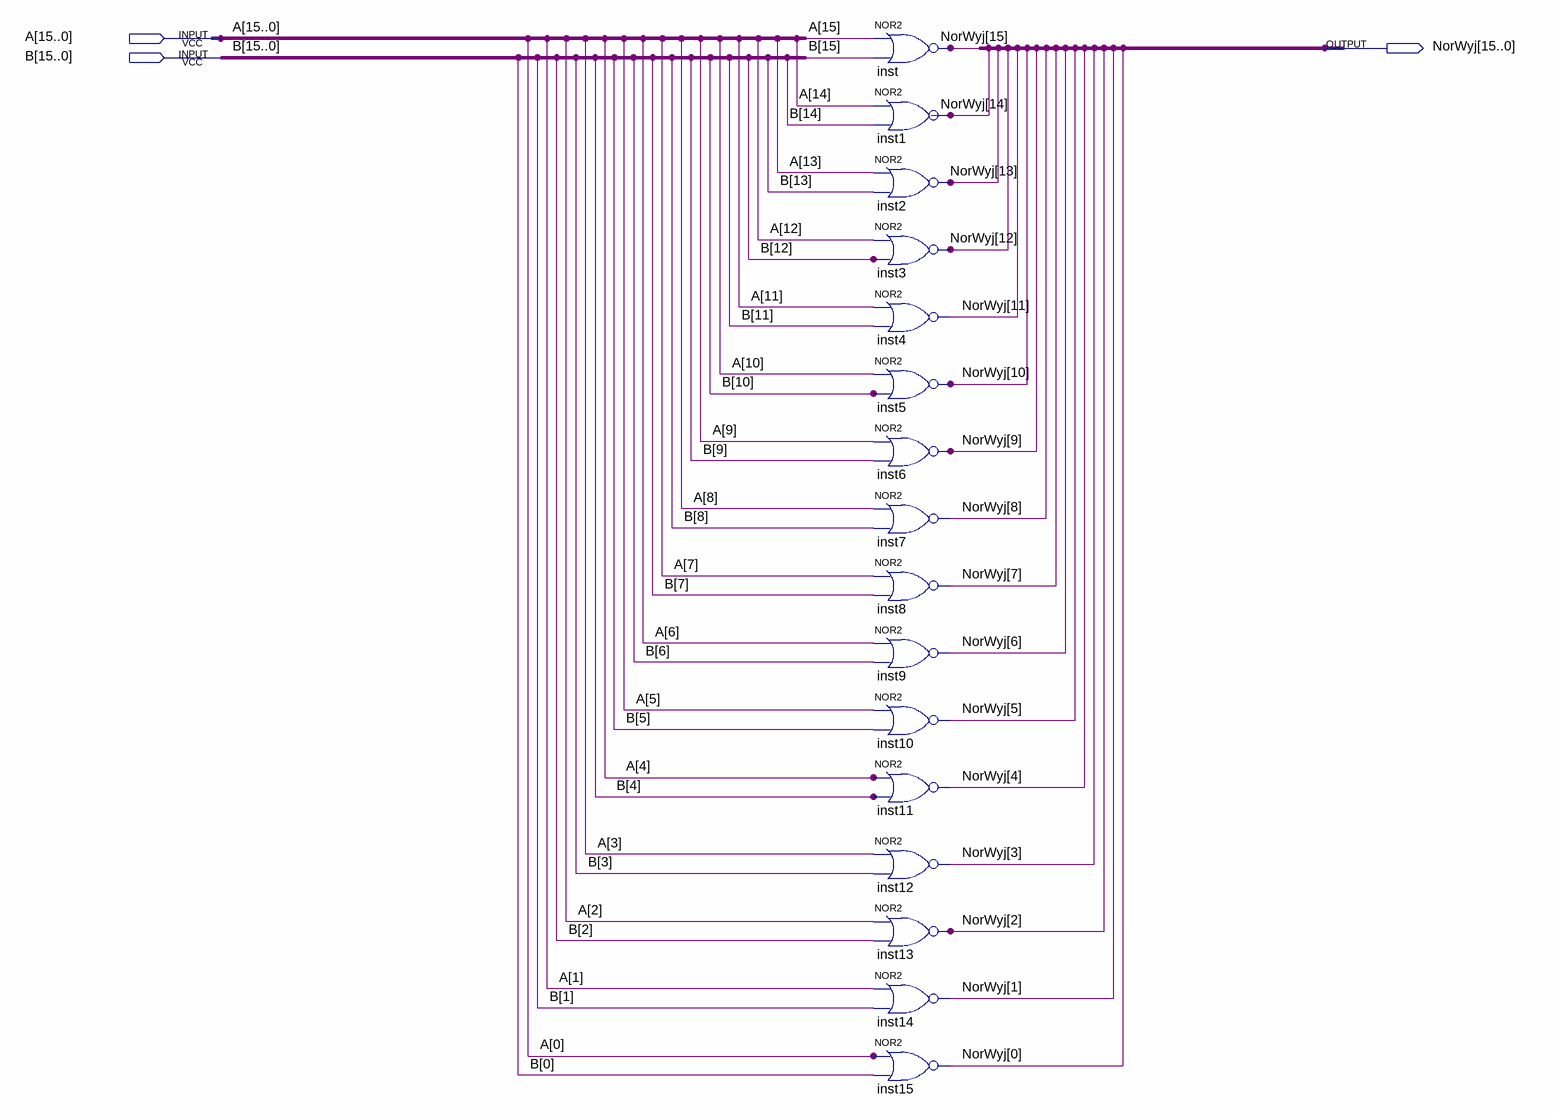
[diagram p0: schematic sheet]
// Quartus schematic norvector.bdf as structural Verilog: 16 symbols, 3 pins
module norvector (
  input  [15:0] A,
  input  [15:0] B,
  output [15:0] NorWyj
);

  nor inst (NorWyj[15], A[15], B[15]);
  nor inst1 (NorWyj[14], A[14], B[14]);
  nor inst2 (NorWyj[13], A[13], B[13]);
  nor inst3 (NorWyj[12], A[12], B[12]);
  nor inst4 (NorWyj[11], A[11], B[11]);
  nor inst5 (NorWyj[10], A[10], B[10]);
  nor inst6 (NorWyj[9], A[9], B[9]);
  nor inst7 (NorWyj[8], A[8], B[8]);
  nor inst8 (NorWyj[7], A[7], B[7]);
  nor inst9 (NorWyj[6], A[6], B[6]);
  nor inst10 (NorWyj[5], A[5], B[5]);
  nor inst11 (NorWyj[4], A[4], B[4]);
  nor inst12 (NorWyj[3], A[3], B[3]);
  nor inst13 (NorWyj[2], A[2], B[2]);
  nor inst14 (NorWyj[1], A[1], B[1]);
  nor inst15 (NorWyj[0], A[0], B[0]);
endmodule
